# Altium project RGBCube2.PrjPcb
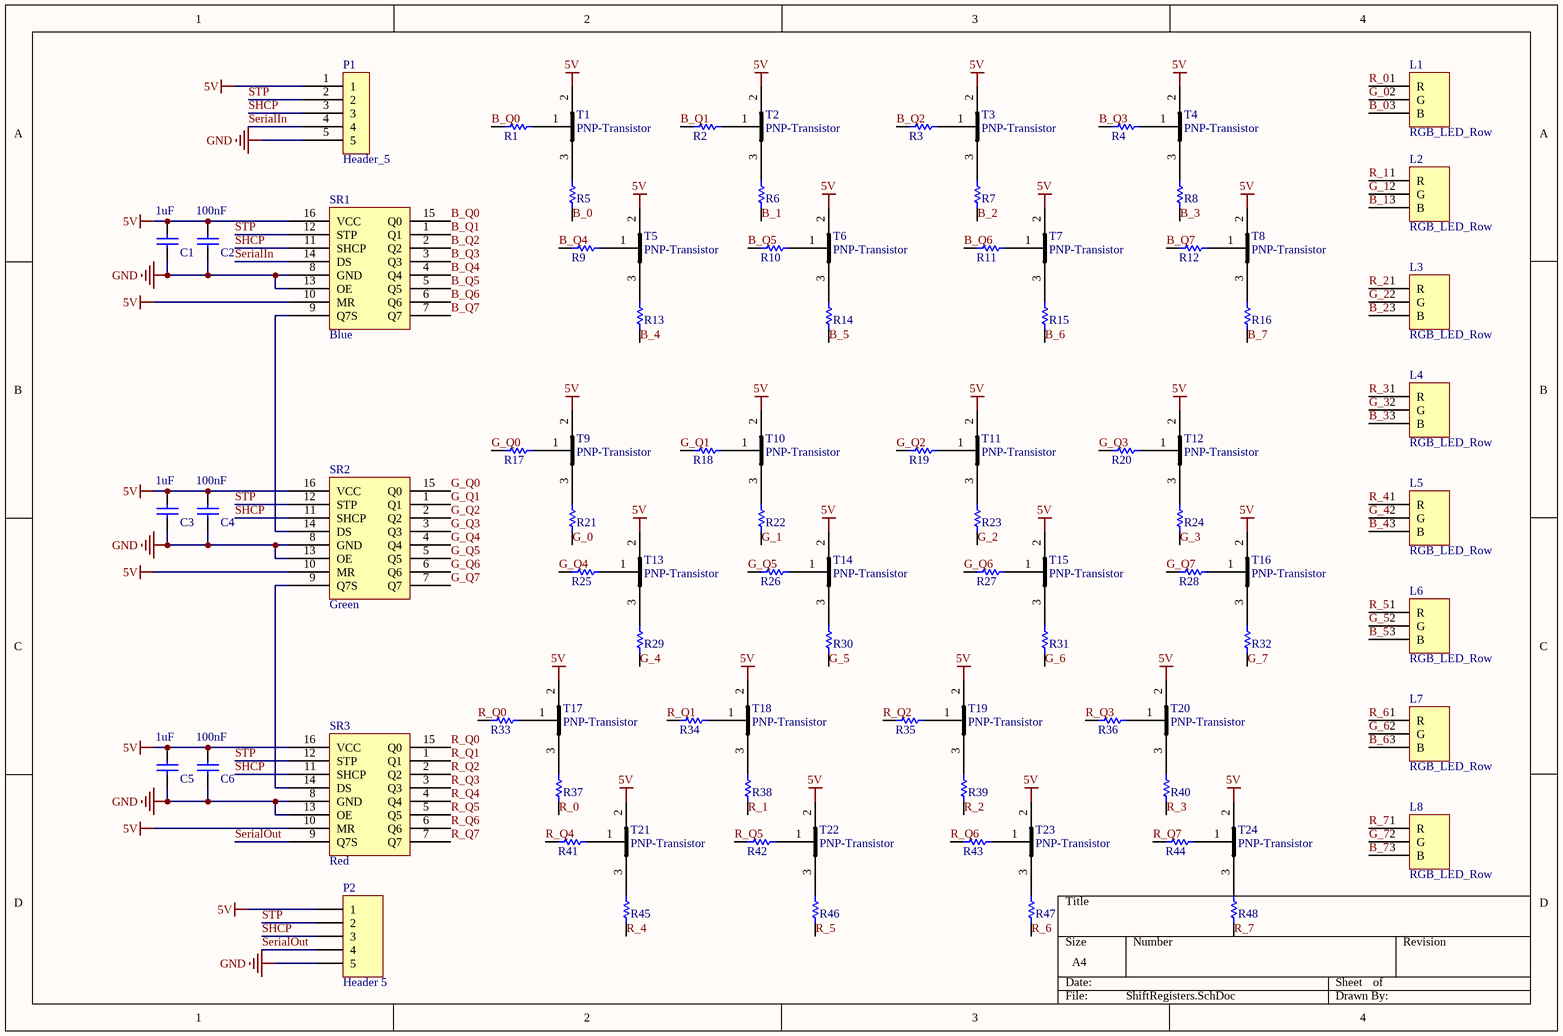
[diagram p0: ShiftRegisters.SchDoc]
1 sheet, 91 parts. Net scope: global (net labels, ports and power ports of the same name join across sheets).
Board file: ShiftRegisters.PcbDoc

## Sheet ShiftRegisters.SchDoc
size A4

### Parts
C1  value 1uF  [CAPC1206(3216)190_L]  (hidden comment: CAP 100nF 16V 1206(3216))
C2  value 100nF  [CAPC1206(3216)190_L]  (hidden comment: CAP 100nF 16V 1206(3216))
C3  value 1uF  [CAPC1206(3216)190_L]  (hidden comment: CAP 100nF 16V 1206(3216))
C4  value 100nF  [CAPC1206(3216)190_L]  (hidden comment: CAP 100nF 16V 1206(3216))
C5  value 1uF  [CAPC1206(3216)190_L]  (hidden comment: CAP 100nF 16V 1206(3216))
C6  value 100nF  [CAPC1206(3216)190_L]  (hidden comment: CAP 100nF 16V 1206(3216))
L1  RGB_LED_Row  [LED_Row]
L2  RGB_LED_Row  [LED_Row]
L3  RGB_LED_Row  [LED_Row]
L4  RGB_LED_Row  [LED_Row]
L5  RGB_LED_Row  [LED_Row]
L6  RGB_LED_Row  [LED_Row]
L7  RGB_LED_Row  [LED_Row]
L8  RGB_LED_Row  [LED_Row]
P1  Header_5  [PinHeader]
P2  Header 5  [HDR1X5]
R1  43k 5% 1206(3216)  [RESC1206(3216)_M]  (value not drawn)
R2  43k 5% 1206(3216)  [RESC1206(3216)_M]  (value not drawn)
R3  43k 5% 1206(3216)  [RESC1206(3216)_M]  (value not drawn)
R4  43k 5% 1206(3216)  [RESC1206(3216)_M]  (value not drawn)
R5  2R 5% 1206(3216)  [RESC1206(3216)_M]  (value not drawn)
R6  2R 5% 1206(3216)  [RESC1206(3216)_M]  (value not drawn)
R7  2R 5% 1206(3216)  [RESC1206(3216)_M]  (value not drawn)
R8  2R 5% 1206(3216)  [RESC1206(3216)_M]  (value not drawn)
R9  43k 5% 1206(3216)  [RESC1206(3216)_M]  (value not drawn)
R10  43k 5% 1206(3216)  [RESC1206(3216)_M]  (value not drawn)
R11  43k 5% 1206(3216)  [RESC1206(3216)_M]  (value not drawn)
R12  43k 5% 1206(3216)  [RESC1206(3216)_M]  (value not drawn)
R13  2R 5% 1206(3216)  [RESC1206(3216)_M]  (value not drawn)
R14  2R 5% 1206(3216)  [RESC1206(3216)_M]  (value not drawn)
R15  2R 5% 1206(3216)  [RESC1206(3216)_M]  (value not drawn)
R16  2R 5% 1206(3216)  [RESC1206(3216)_M]  (value not drawn)
R17  43k 5% 1206(3216)  [RESC1206(3216)_M]  (value not drawn)
R18  43k 5% 1206(3216)  [RESC1206(3216)_M]  (value not drawn)
R19  43k 5% 1206(3216)  [RESC1206(3216)_M]  (value not drawn)
R20  43k 5% 1206(3216)  [RESC1206(3216)_M]  (value not drawn)
R21  2R 5% 1206(3216)  [RESC1206(3216)_M]  (value not drawn)
R22  2R 5% 1206(3216)  [RESC1206(3216)_M]  (value not drawn)
R23  2R 5% 1206(3216)  [RESC1206(3216)_M]  (value not drawn)
R24  2R 5% 1206(3216)  [RESC1206(3216)_M]  (value not drawn)
R25  43k 5% 1206(3216)  [RESC1206(3216)_M]  (value not drawn)
R26  43k 5% 1206(3216)  [RESC1206(3216)_M]  (value not drawn)
R27  43k 5% 1206(3216)  [RESC1206(3216)_M]  (value not drawn)
R28  43k 5% 1206(3216)  [RESC1206(3216)_M]  (value not drawn)
R29  2R 5% 1206(3216)  [RESC1206(3216)_M]  (value not drawn)
R30  2R 5% 1206(3216)  [RESC1206(3216)_M]  (value not drawn)
R31  2R 5% 1206(3216)  [RESC1206(3216)_M]  (value not drawn)
R32  2R 5% 1206(3216)  [RESC1206(3216)_M]  (value not drawn)
R33  43k 5% 1206(3216)  [RESC1206(3216)_M]  (value not drawn)
R34  43k 5% 1206(3216)  [RESC1206(3216)_M]  (value not drawn)
R35  43k 5% 1206(3216)  [RESC1206(3216)_M]  (value not drawn)
R36  43k 5% 1206(3216)  [RESC1206(3216)_M]  (value not drawn)
R37  2R 5% 1206(3216)  [RESC1206(3216)_M]  (value not drawn)
R38  2R 5% 1206(3216)  [RESC1206(3216)_M]  (value not drawn)
R39  2R 5% 1206(3216)  [RESC1206(3216)_M]  (value not drawn)
R40  2R 5% 1206(3216)  [RESC1206(3216)_M]  (value not drawn)
R41  43k 5% 1206(3216)  [RESC1206(3216)_M]  (value not drawn)
R42  43k 5% 1206(3216)  [RESC1206(3216)_M]  (value not drawn)
R43  43k 5% 1206(3216)  [RESC1206(3216)_M]  (value not drawn)
R44  43k 5% 1206(3216)  [RESC1206(3216)_M]  (value not drawn)
R45  2R 5% 1206(3216)  [RESC1206(3216)_M]  (value not drawn)
R46  2R 5% 1206(3216)  [RESC1206(3216)_M]  (value not drawn)
R47  2R 5% 1206(3216)  [RESC1206(3216)_M]  (value not drawn)
R48  2R 5% 1206(3216)  [RESC1206(3216)_M]  (value not drawn)
SR1  Blue  [SOP16]
SR2  Green  [SOP16]
SR3  Red  [SOP16]
T1  PNP-Transistor  [SOT-223]
T2  PNP-Transistor  [SOT-223]
T3  PNP-Transistor  [SOT-223]
T4  PNP-Transistor  [SOT-223]
T5  PNP-Transistor  [SOT-223]
T6  PNP-Transistor  [SOT-223]
T7  PNP-Transistor  [SOT-223]
T8  PNP-Transistor  [SOT-223]
T9  PNP-Transistor  [SOT-223]
T10  PNP-Transistor  [SOT-223]
T11  PNP-Transistor  [SOT-223]
T12  PNP-Transistor  [SOT-223]
T13  PNP-Transistor  [SOT-223]
T14  PNP-Transistor  [SOT-223]
T15  PNP-Transistor  [SOT-223]
T16  PNP-Transistor  [SOT-223]
T17  PNP-Transistor  [SOT-223]
T18  PNP-Transistor  [SOT-223]
T19  PNP-Transistor  [SOT-223]
T20  PNP-Transistor  [SOT-223]
T21  PNP-Transistor  [SOT-223]
T22  PNP-Transistor  [SOT-223]
T23  PNP-Transistor  [SOT-223]
T24  PNP-Transistor  [SOT-223]

### Nets
5V: C1.1 C2.1 C3.1 C4.1 C5.1 C6.1 P1.1 P2.1 SR1.10(MR) SR1.16(VCC) SR2.10(MR) SR2.16(VCC) SR3.10(MR) SR3.16(VCC) T1.2(Collector) T2.2(Collector) T3.2(Collector) T4.2(Collector) T5.2(Collector) T6.2(Collector) T7.2(Collector) T8.2(Collector) T9.2(Collector) T10.2(Collector) T11.2(Collector) T12.2(Collector) T13.2(Collector) T14.2(Collector) T15.2(Collector) T16.2(Collector) T17.2(Collector) T18.2(Collector) T19.2(Collector) T20.2(Collector) T21.2(Collector) T22.2(Collector) T23.2(Collector) T24.2(Collector)
GND: C1.2 C2.2 C3.2 C4.2 C5.2 C6.2 P1.5 P2.5 SR1.8(GND) SR1.13(OE) SR2.8(GND) SR2.13(OE) SR3.8(GND) SR3.13(OE)
B_0: L1.3(B) R5.1
B_1: L2.3(B) R6.1
B_2: L3.3(B) R7.1
B_3: L4.3(B) R8.1
B_4: L5.3(B) R13.1
B_5: L6.3(B) R14.1
B_6: L7.3(B) R15.1
B_7: L8.3(B) R16.1
B_Q0: R1.1 SR1.15(Q0)
B_Q1: R2.1 SR1.1(Q1)
B_Q2: R3.1 SR1.2(Q2)
B_Q3: R4.1 SR1.3(Q3)
B_Q4: R9.1 SR1.4(Q4)
B_Q5: R10.1 SR1.5(Q5)
B_Q6: R11.1 SR1.6(Q6)
B_Q7: R12.1 SR1.7(Q7)
G_0: L1.2(G) R21.1
G_1: L2.2(G) R22.1
G_2: L3.2(G) R23.1
G_3: L4.2(G) R24.1
G_4: L5.2(G) R29.1
G_5: L6.2(G) R30.1
G_6: L7.2(G) R31.1
G_7: L8.2(G) R32.1
G_Q0: R17.1 SR2.15(Q0)
G_Q1: R18.1 SR2.1(Q1)
G_Q2: R19.1 SR2.2(Q2)
G_Q3: R20.1 SR2.3(Q3)
G_Q4: R25.1 SR2.4(Q4)
G_Q5: R26.1 SR2.5(Q5)
G_Q6: R27.1 SR2.6(Q6)
G_Q7: R28.1 SR2.7(Q7)
R_0: L1.1(R) R37.1
R_1: L2.1(R) R38.1
R_2: L3.1(R) R39.1
R_3: L4.1(R) R40.1
R_4: L5.1(R) R45.1
R_5: L6.1(R) R46.1
R_6: L7.1(R) R47.1
R_7: L8.1(R) R48.1
R_Q0: R33.1 SR3.15(Q0)
R_Q1: R34.1 SR3.1(Q1)
R_Q2: R35.1 SR3.2(Q2)
R_Q3: R36.1 SR3.3(Q3)
R_Q4: R41.1 SR3.4(Q4)
R_Q5: R42.1 SR3.5(Q5)
R_Q6: R43.1 SR3.6(Q6)
R_Q7: R44.1 SR3.7(Q7)
SerialIn: P1.4 SR1.14(DS)
SerialOut: P2.4 SR3.9(Q7S)
SHCP: P1.3 P2.3 SR1.11(SHCP) SR2.11(SHCP) SR3.11(SHCP)
STP: P1.2 P2.2 SR1.12(STP) SR2.12(STP) SR3.12(STP)
NetR1_2: R1.2 T1.1(Base)
NetR2_2: R2.2 T2.1(Base)
NetR3_2: R3.2 T3.1(Base)
NetR4_2: R4.2 T4.1(Base)
NetR5_2: R5.2 T1.3(Emitter)
NetR6_2: R6.2 T2.3(Emitter)
NetR7_2: R7.2 T3.3(Emitter)
NetR8_2: R8.2 T4.3(Emitter)
NetR9_2: R9.2 T5.1(Base)
NetR10_2: R10.2 T6.1(Base)
NetR11_2: R11.2 T7.1(Base)
NetR12_2: R12.2 T8.1(Base)
NetR13_2: R13.2 T5.3(Emitter)
NetR14_2: R14.2 T6.3(Emitter)
NetR15_2: R15.2 T7.3(Emitter)
NetR16_2: R16.2 T8.3(Emitter)
NetR17_2: R17.2 T9.1(Base)
NetR18_2: R18.2 T10.1(Base)
NetR19_2: R19.2 T11.1(Base)
NetR20_2: R20.2 T12.1(Base)
NetR21_2: R21.2 T9.3(Emitter)
NetR22_2: R22.2 T10.3(Emitter)
NetR23_2: R23.2 T11.3(Emitter)
NetR24_2: R24.2 T12.3(Emitter)
NetR25_2: R25.2 T13.1(Base)
NetR26_2: R26.2 T14.1(Base)
NetR27_2: R27.2 T15.1(Base)
NetR28_2: R28.2 T16.1(Base)
NetR29_2: R29.2 T13.3(Emitter)
NetR30_2: R30.2 T14.3(Emitter)
NetR31_2: R31.2 T15.3(Emitter)
NetR32_2: R32.2 T16.3(Emitter)
NetR33_2: R33.2 T17.1(Base)
NetR34_2: R34.2 T18.1(Base)
NetR35_2: R35.2 T19.1(Base)
NetR36_2: R36.2 T20.1(Base)
NetR37_2: R37.2 T17.3(Emitter)
NetR38_2: R38.2 T18.3(Emitter)
NetR39_2: R39.2 T19.3(Emitter)
NetR40_2: R40.2 T20.3(Emitter)
NetR41_2: R41.2 T21.1(Base)
NetR42_2: R42.2 T22.1(Base)
NetR43_2: R43.2 T23.1(Base)
NetR44_2: R44.2 T24.1(Base)
NetR45_2: R45.2 T21.3(Emitter)
NetR46_2: R46.2 T22.3(Emitter)
NetR47_2: R47.2 T23.3(Emitter)
NetR48_2: R48.2 T24.3(Emitter)
NetSR1_9: SR1.9(Q7S) SR2.14(DS)
NetSR2_9: SR2.9(Q7S) SR3.14(DS)

### Library data of the parts
C1-C6 = CMP-1037-04176-1: CAP 100nF 16V Â±1% 1206 (3216 Metric) Thickness 1.9mm SMD; Case-Metric: 3216; Case-EIA: 1206; Max Thickness: 1.9 mm; Rated Voltage: 16 V; Technology: SMT; Tolerance: Â±1%
P2 = Header 5: Header, 5-Pin; LatestRevisionDate: 17-Jul-2002; LatestRevisionNote: Re-released for DXP Platform.; Publisher: Altium Limited
R1-R4 R9-R12 R17-R20 R25-R28 R33-R36 R41-R44 = CMP-1014-00009-1: 43k 0.25W 5% 1206 (3216 Metric)  SMD; Case-EIA: 1206; Value: 2.00 Ohm; Case-Metric: 3216; Technology: SMT; Tolerance: 5 %; Power: 0.25 W
R5-R8 R13-R16 R21-R24 R29-R32 R37-R40 R45-R48 = CMP-1014-00009-1: 2R 0.25W 5% 1206 (3216 Metric)  SMD; Case-EIA: 1206; Value: 2.00 Ohm; Case-Metric: 3216; Technology: SMT; Tolerance: 5 %; Power: 0.25 W
SR1-SR3 = 74HC595: 74HC595 Farnell:  2098004
T1-T24 = PNP-Transistor: Reichelt: BCP 51-16 NXP